# Altium project TP_Conv1.1.PrjPcb
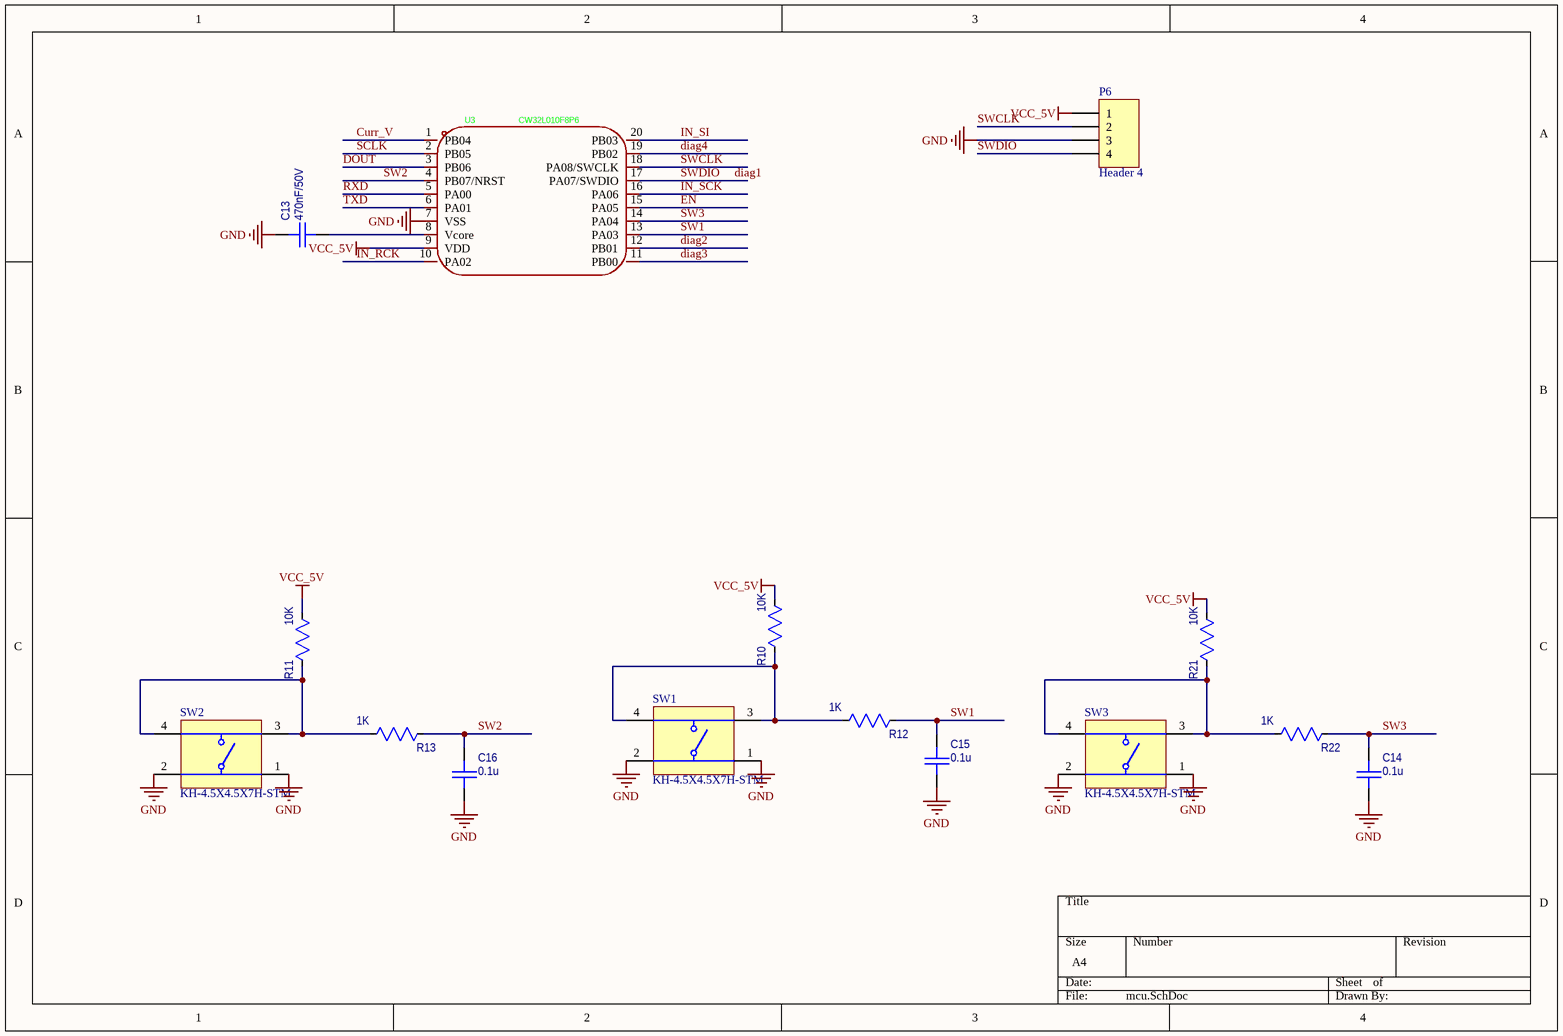
[diagram p0: mcu.SchDoc]
1 sheet, 15 parts. Net scope: global (net labels, ports and power ports of the same name join across sheets).
Board file: sensor_V1.1.PcbDoc

## Sheet mcu.SchDoc
size A4; SheetNumber: 2; SheetTotal: 4

### Parts
C13  value 470nF/50V  [CAPC1608X092N_0603]  (hidden comment: Capacitor_0603)
C14  value 0.1u  [CAPC1608X092N_0603]  (hidden comment: Capacitor_0603)
C15  value 0.1u  [CAPC1608X092N_0603]  (hidden comment: Capacitor_0603)
C16  value 0.1u  [CAPC1608X092N_0603]  (hidden comment: Capacitor_0603)
P6  Header 4  [1.27-4P]  (no BOM)
R10  10K  [RESC1608X055N_0603]
R11  10K  [RESC1608X055N_0603]
R12  value 1K  [RESC1608X055N_0603]  (hidden comment: 1K/1%)
R13  value 1K  [RESC1608X055N_0603]  (hidden comment: 1K/1%)
R21  10K  [RESC1608X055N_0603]
R22  value 1K  [RESC1608X055N_0603]  (hidden comment: 1K/1%)
SW1  KH-4.5X4.5X7H-STM  [SW-SMD_4P-L4.5-W4.5-P3.00-LS6.8]
SW2  KH-4.5X4.5X7H-STM  [SW-SMD_4P-L4.5-W4.5-P3.00-LS6.8]
SW3  KH-4.5X4.5X7H-STM  [SW-SMD_4P-L4.5-W4.5-P3.00-LS6.8]
U3  CW32L010F8P6  [TSSOP-20_L6.5-W4.4-P0.65-LS6.4-BL]

### Nets
GND: C13.1 C14.2 C15.2 C16.2 P6.3 SW1.1 SW1.2 SW2.1 SW2.2 SW3.1 SW3.2 U3.7(VSS)
VCC_5V: P6.1 R10.1 R11.1 R21.1 U3.9(VDD)
Curr_V: U3.1(PB04)
diag1: P6.4 U3.17(PA07/SWDIO)  [also labelled SWDIO]
diag2: U3.12(PB01)
diag3: U3.11(PB00)
diag4: U3.19(PB02)
DOUT: U3.3(PB06)
EN: U3.15(PA05)
IN_RCK: U3.10(PA02)
IN_SCK: U3.16(PA06)
IN_SI: U3.20(PB03)
RXD: U3.5(PA00)
SCLK: U3.2(PB05)
SW1: C15.1 R12.2 U3.13(PA03)
SW2: C16.1 R13.2 U3.4(PB07/NRST)
SW3: C14.1 R22.2 U3.14(PA04)
SWCLK: P6.2 U3.18(PA08/SWCLK)
TXD: U3.6(PA01)
NetC13_2: C13.2 U3.8(Vcore)
NetR10_2: R10.2 R12.1 SW1.3 SW1.4
NetR11_2: R11.2 R13.1 SW2.3 SW2.4
NetR21_2: R21.2 R22.1 SW3.3 SW3.4

### Library data of the parts
C13-C16 = Capacitor_0603: Capacitor, MLCC; Manufacturer: KEMET; PartNumber: C0603C104M5RACTU; Tolerance: [tol]; TempCo: [tempco]; Voltage Rating: [voltage]; ComponentLink1URL: *; Current Rating: *; ComponentLink1Description: Datasheet; Power Rating: *; Package: 0603; SupplierDescription: CAP CER 0.1UF 50V X7R 0603
R10-R13 R21 R22 = Resistor_0603: Resistor, Standard; Manufacturer: Yageo; PartNumber: RC0603FR-1075KL; Power Rating: [power]; TempCo: [tempco]; Tolerance: tol; ComponentLink1URL: *; ComponentLink1Description: Datasheet; Package: 0603; SupplierDescription: RES SMD 75K OHM 1% 1/10W 0603
  R10 R11 R21: Value: 10K
SW1-SW3 = J1L0503110: Tactile Switch, 6 × 6 mm, Height 5.0mm, 4-Pin THD; Min Operating Temperature: -25 degC; Max Operating Temperature: 70 degC; PartNumber: J1L0503110
U3 = CW32L010F8P6: Manufacturer: CW(芯源); Add into BOM: yes; CPU Core: ARM Cortex-M0+; Program Storage Size: 64KB; RAM Size: 4KB; Operating Voltage Range: 1.62V~5.5V; CPU Maximum Speed: 48MHz; Program Memory Type: FLASH; ADC (Bit): 12bit; PWM (Bit): 16bit; 16Bit Timer: 6; 32Bit Timer: 1; UART/USART: 2; Watchdog: 有; Symbol: CW32L010F8P6; Device: CW32L010F8P6; LCSC Part Name: 单片机（超低功耗MCU）CW32L010F8P6; Supplier Part: C41425332; Manufacturer Part: CW32L010F8P6; Supplier Footprint: TSSOP-20; Datasheet: https://atta.szlcsc.com/upload/public/pdf/source/20241016/B2F7E6511F33DFEE1FF291443365E705.pdf; Supplier: LCSC; Convert to PCB: yes; EEPROM: -; Operating Temperature Range: -40℃~+85℃; I2C: 1; SPI: 1; Internal Comparator: 2; Real-Time Clock: 有; Infrared Data Association: 有; Low-Voltage Detect: 有; CCP Capture/Compare: 有; Internal Oscillator: 有
P6 = Header 4: Publisher: Altium Limited